# EAGLE schematic MAX86176_WRIST_EVKIT_D (EAGLE 9.2.2)

## Sheet 1 of 2
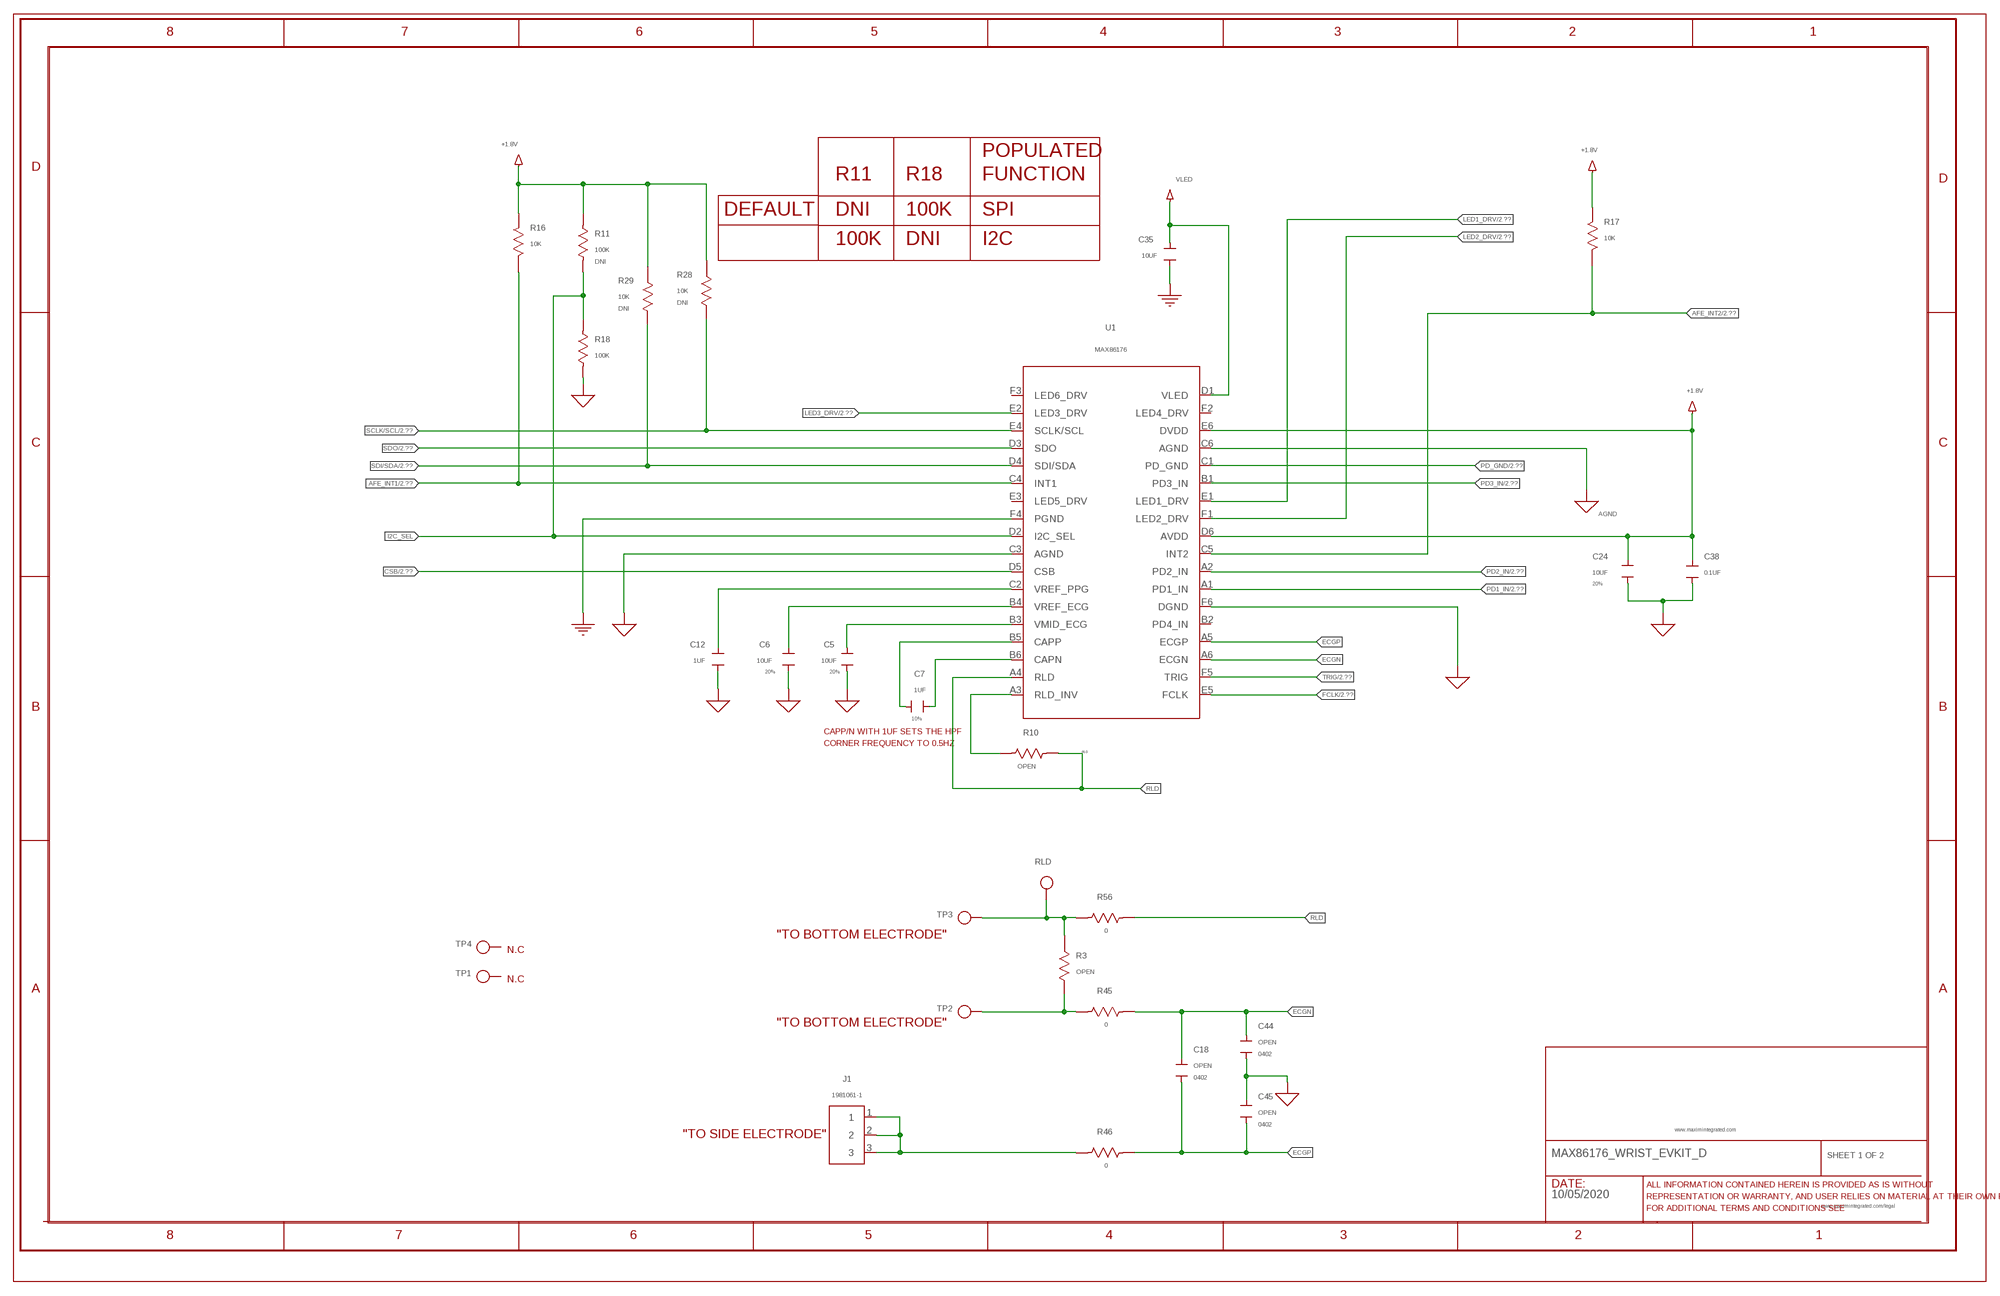
[diagram p0: schematic, sheet 1]
MAXIM_B_SIZE_CF_SYM_1_INST_0 (MAXIM_B_SIZE_CF): COLOR: Default; COMMENT_BODY: TRUE; CURRENT_DESIGN_SHEET: Page 1; CUSTOM_TXT_CDS21: SHEET 1 OF 2; DATE_TXT_CDS: 10/05/2020; DESIGN_CREATE_DATE: Monday, April 19, 2021; DESIGN_CREATE_TIME: 17:09:17; DESIGN_FILE_NAME: C:\TEST\ELGRIS\CHDL2EAGLE\MAXIM\MAX86176\MAX86176_WRIST_EVKIT_D.DSN; DESIGN_MODIFY_DATE: Tuesday, April 20, 2021; DESIGN_MODIFY_TIME: 16:32:23; DESIGN_NAME: C:\TEST\ELGRIS\CHDL2EAGLE\MAXIM\MAX86176\MAX86176_WRIST_EVKIT_D.DSN; LEGAL_WEBLINK_TXT_CDS: www.maximintegrated.com/legal; LOCATION_X-COORDINATE: 5; LOCATION_Y-COORDINATE: 4; ORIGINALSYMBOLORIGIN: (175,5230); PAGE_CREATE_DATE: Monday, April 19, 2021; PAGE_CREATE_TIME: 17:09:20; PAGE_MODIFY_DATE: Tuesday, April 20, 2021; PAGE_MODIFY_TIME: 16:32:23; PAGE_NUMBER: 1; PAGE_SIZE: Custom; PROJECT_TITLE_TXT_CDS: MAX86176_WRIST_EVKIT_D; SCHEMATIC_CREATE_DATE: Monday, April 19, 2021; SCHEMATIC_CREATE_TIME: 10:09:22; SCHEMATIC_MODIFY_DATE: Tuesday, April 20, 2021; SCHEMATIC_MODIFY_TIME: 09:32:24; SCHEMATIC_NAME: MAX86176_WRIST_EVKIT_D; SCHEMATIC_PAGE_COUNT: 2; SCHEMATIC_PAGE_NUMBER: 1; SOURCE_LIBRARY: D:\MAXIM\CHDL2EAGLE\19APR21\MAXREFDES104\MAX86176_WRIST_EVKIT_D\MML.OLB; SOURCE_SYMBOL: MAXIM_B_SIZE_CF; WEBLINK1_TXT_CDS: www.maximintegrated.com

### Parts
C5  10UF  CAP_NP#1CAP_NP#1_1  [0402]
C6  10UF  CAP_NP#1CAP_NP#1_1  [0402]
C7  1UF  CAP_NP#1CAP_NP#1  [0603]
C12  1UF  CAP_NPCAP_NP_1  [0402]
C18  OPEN  EVK_GENERIC_CAPACITORS  [0402]
C24  10UF  EK_CAP_NP#1  [0603]
C35  10UF  EK_CAP_NP  [0603]
C38  0.1UF  CAP_NPCAP_NP_2  [0603]
C44  OPEN  EVK_GENERIC_CAPACITORS  [0402]
C45  OPEN  EVK_GENERIC_CAPACITORS  [0402]
J1  1981061-1  [TECO_1981061-1]
R3  OPEN  EVK_GENERIC_RESISTORS#1  [RESC0603X33M]
R10  OPEN  EVK_GENERIC_RESISTORSEVK_GENERIC_RESISTORS_1  [0402]
R11  100K  RES_SMD#1RES_SMD#1_1  [0402]
R16  10K  RES_SMD  [0402]
R17  10K  RES_SMD  [0402]
R18  100K  RES_SMD#1RES_SMD#1_1  [0402]
R28  10K  RES_SMD  [0402]
R29  10K  RES_SMD  [0402]
R45  0  RES_SMD#1RES_SMD#1_1  [0402]
R46  0  RES_SMD#1RES_SMD#1_1  [0402]
R56  0  RES_SMD#1RES_SMD#1_1  [0402]
RLD  N/A  TPTP  [TP_C25H12]
TP1  N/A  TPTP_1  [TP_S_SQUARE_3-50]
TP2  N/A  TPTP_1  [TP_S_SQUARE_3-50]
TP3  N/A  TPTP_1  [TP_S_SQUARE_3-50]
TP4  N/A  TPTP_1  [TP_S_SQUARE_3-50]
U1  MAX86176  EK_MAX86176  [MAXIM_21-100413]

### Nets
+1.8V: C24.2 C38.2 R11.2 R16.2 R17.2 R28.1 R29.1 U1.D6(AVDD) U1.E6(DVDD) ; also sheet 2
AFE_INT1: R16.1 U1.C4(INT1) ; also sheet 2
AFE_INT2: R17.1 U1.C5(INT2) ; also sheet 2
AGND: C5.1 C6.1 C12.1 C24.1 C38.1 C44.1 C45.2 R18.1 U1.C3(AGND) U1.C6(AGND) U1.F6(DGND) ; also sheet 2
CSB: U1.D5(CSB) ; also sheet 2
ECGN: C18.2 C44.2 R45.2 U1.A6(ECGN)
ECGP: C18.1 C45.1 R46.2 U1.A5(ECGP)
FCLK: U1.E5(FCLK) ; also sheet 2
I2C_SEL: R11.1 R18.2 U1.D2(I2C_SEL)
LED1_DRV: U1.E1(LED1_DRV) ; also sheet 2
LED2_DRV: U1.F1(LED2_DRV) ; also sheet 2
LED3_DRV: U1.E2(LED3_DRV) ; also sheet 2
N00317: J1.1 J1.2 J1.3 R46.1
N00329: C7.1 U1.B6(CAPN)
N00335: C7.2 U1.B5(CAPP)
N00341: C5.2 U1.B3(VMID_ECG)
N00345: C6.2 U1.B4(VREF_ECG)
N00349: C12.2 U1.C2(VREF_PPG)
N00353: R10.1 U1.A3(RLD_INV)
N00359: R3.2 R45.1 TP2.1(TP1)
N00365: R3.1 R56.1 RLD.1(TP1) TP3.1(TP1)
PD1_IN: U1.A1(PD1_IN) ; also sheet 2
PD2_IN: U1.A2(PD2_IN) ; also sheet 2
PD3_IN: U1.B1(PD3_IN) ; also sheet 2
PD_GND: U1.C1(PD_GND) ; also sheet 2
PGND: C35.1 U1.F4(PGND) ; also sheet 2
RLD: R10.2 R56.2 U1.A4(RLD)
SCLK/SCL: R28.2 U1.E4(SCLK/SCL) ; also sheet 2
SDI/SDA: R29.2 U1.D4(SDI/SDA) ; also sheet 2
SDO: U1.D3(SDO) ; also sheet 2
TRIG: U1.F5(TRIG) ; also sheet 2
VLED: C35.2 U1.D1(VLED) ; also sheet 2
Unconnected: TP1.1(TP1) TP4.1(TP1) U1.B2(PD4_IN) U1.E3(LED5_DRV) U1.F2(LED4_DRV) U1.F3(LED6_DRV)

### Notes on the sheet
- POPULATED
- R11 | R18 | FUNCTION
- DEFAULT | DNI | 100K | SPI
- 100K | DNI | I2C
- CAPP/N WITH 1UF SETS THE HPF
- CORNER FREQUENCY TO 0.5HZ
- "TO BOTTOM ELECTRODE"
- N.C
- N.C
- "TO BOTTOM ELECTRODE"
- "TO SIDE ELECTRODE"

## Sheet 2 of 2
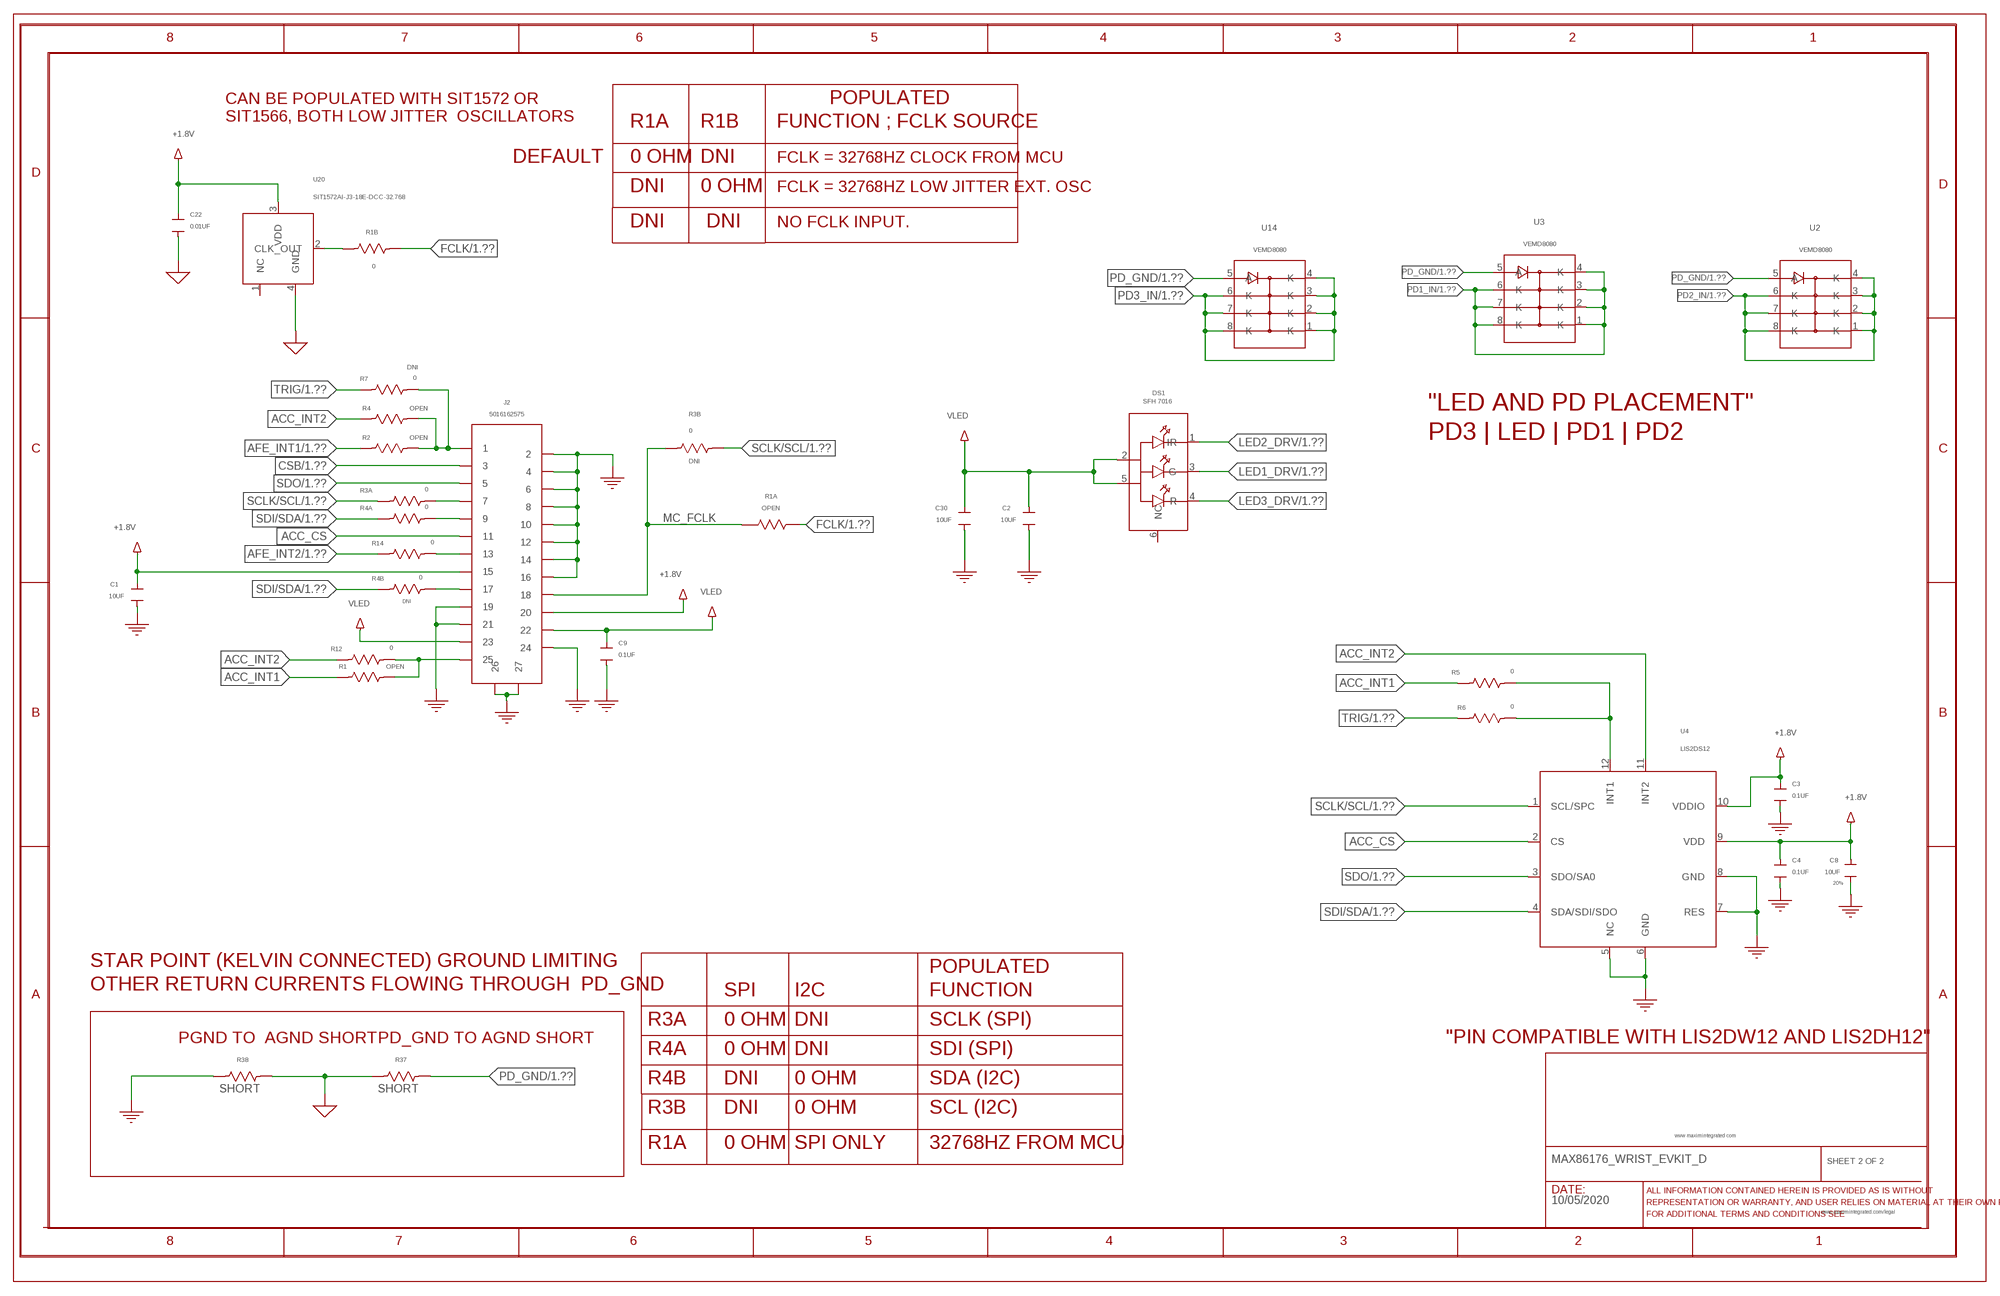
[diagram p1: schematic, sheet 2]
MAXIM_B_SIZE_CF_SYM_1_INST_1___1 (MAXIM_B_SIZE_CF): COLOR: Default; COMMENT_BODY: TRUE; CURRENT_DESIGN_SHEET: page 2; CUSTOM_TXT_CDS21: SHEET 2 OF 2; DATE_TXT_CDS: 10/05/2020; DESIGN_CREATE_DATE: Monday, April 19, 2021; DESIGN_CREATE_TIME: 17:09:17; DESIGN_FILE_NAME: C:\TEST\ELGRIS\CHDL2EAGLE\MAXIM\MAX86176\MAX86176_WRIST_EVKIT_D.DSN; DESIGN_MODIFY_DATE: Tuesday, April 20, 2021; DESIGN_MODIFY_TIME: 16:32:23; DESIGN_NAME: C:\TEST\ELGRIS\CHDL2EAGLE\MAXIM\MAX86176\MAX86176_WRIST_EVKIT_D.DSN; LEGAL_WEBLINK_TXT_CDS: www.maximintegrated.com/legal; LOCATION_X-COORDINATE: 5; LOCATION_Y-COORDINATE: 9; ORIGINALSYMBOLORIGIN: (175,5230); PAGE_CREATE_DATE: Monday, April 19, 2021; PAGE_CREATE_TIME: 17:09:20; PAGE_MODIFY_DATE: Tuesday, April 20, 2021; PAGE_MODIFY_TIME: 16:32:23; PAGE_NUMBER: 2; PAGE_SIZE: Custom; PROJECT_TITLE_TXT_CDS: MAX86176_WRIST_EVKIT_D; SCHEMATIC_CREATE_DATE: Monday, April 19, 2021; SCHEMATIC_CREATE_TIME: 10:09:22; SCHEMATIC_MODIFY_DATE: Tuesday, April 20, 2021; SCHEMATIC_MODIFY_TIME: 09:32:24; SCHEMATIC_NAME: MAX86176_WRIST_EVKIT_D; SCHEMATIC_PAGE_COUNT: 2; SCHEMATIC_PAGE_NUMBER: 2; SOURCE_LIBRARY: D:\MAXIM\CHDL2EAGLE\19APR21\MAXREFDES104\MAX86176_WRIST_EVKIT_D\MML.OLB; SOURCE_SYMBOL: MAXIM_B_SIZE_CF; WEBLINK1_TXT_CDS: www.maximintegrated.com

### Parts
C1  10UF  EK_CAP_NP  [0603]
C2  10UF  EK_CAP_NP  [0603]
C3  0.1UF  CAP_NPCAP_NP_2  [0603]
C4  0.1UF  CAP_NPCAP_NP_2  [0603]
C8  10UF  CAP_NP#1CAP_NP#1_1  [0402]
C9  0.1UF  CAP_NPCAP_NP  [CAPC0603X33M]
C22  0.01UF  CAP_NPCAP_NP  [CAPC0603X33M]
C30  10UF  EK_CAP_NP  [0603]
DS1  SFH 7016  LED_6P  [LED_SFH7016]
J2  5016162575  501616-2575  [MOLEX_501616-2575]
R1  OPEN  EVK_GENERIC_RESISTORSEVK_GENERIC_RESISTORS_1  [0402]
R1A  OPEN  EVK_GENERIC_RESISTORS#1  [RESC0603X33M]
R1B  0  RES_SMD#1RES_SMD#1  [RESC0603X33M]
R2  OPEN  EVK_GENERIC_RESISTORSEVK_GENERIC_RESISTORS_1  [0402]
R3A  0  RES_SMD#1RES_SMD#1_1  [0402]
R3B  0  RES_SMD#1RES_SMD#1_1  [0402]
R4  OPEN  EVK_GENERIC_RESISTORSEVK_GENERIC_RESISTORS_1  [0402]
R4A  0  RES_SMD#1RES_SMD#1_1  [0402]
R4B  0  RES_SMD#1RES_SMD#1_1  [0402]
R5  0  RES_SMD#1RES_SMD#1  [RESC0603X33M]
R6  0  RES_SMD#1RES_SMD#1  [RESC0603X33M]
R7  0  RES_SMD#1RES_SMD#1  [RESC0603X33M]
R12  0  RES_SMD#1RES_SMD#1  [RESC0603X33M]
R14  0  RES_SMD#1RES_SMD#1  [RESC0603X33M]
R37  SHORT  EVK_GENERIC_RESISTORSEVK_GENERIC_RESISTORS  [RESC0603X23L_SHORT]
R38  SHORT  EVK_GENERIC_RESISTORSEVK_GENERIC_RESISTORS  [RESC0603X23L_SHORT]
U2  VEMD8080  DIO_PIN_8P  [DIO_VEMD8080]
U3  VEMD8080  DIO_PIN_8P  [DIO_VEMD8080]
U4  LIS2DS12  [STMC_LGA-12]
U14  VEMD8080  DIO_PIN_8P  [DIO_VEMD8080]
U20  SIT1572AI-J3-18E-DCC-32.768  SIT1572  [OSC_SIT1572XX-JX-XXX]

### Nets
+1.8V: C1.2 C3.2 C4.2 C8.2 C22.2 J2.15 J2.20 U4.9(VDD) U4.10(VDDIO) U20.3(VDD) ; also sheet 1
ACC_CS: J2.11 U4.2(CS)
ACC_INT1: R1.1 R5.1
ACC_INT2: R4.1 R12.1 U4.11(INT2)
AFE_INT1: R2.1 ; also sheet 1
AFE_INT2: R14.1 ; also sheet 1
AGND: C22.1 R37.1 R38.2 U20.4(GND) ; also sheet 1
CSB: J2.3 ; also sheet 1
FCLK: R1A.2 R1B.2 ; also sheet 1
LED1_DRV: DS1.3(G) ; also sheet 1
LED2_DRV: DS1.1(IR) ; also sheet 1
LED3_DRV: DS1.4(R) ; also sheet 1
MC_FCLK: J2.18 R1A.1 R3B.1
N01067: J2.1 R2.2 R4.2 R7.2
N01081: J2.13 R14.2
N01083: J2.17 R4B.2
N01085: J2.25 R1.2 R12.2
N01093: J2.7 R3A.2
N01095: J2.9 R4A.2
N01097: R5.2 R6.2 U4.12(INT1)
N01105: R1B.1 U20.2(CLK_OUT)
PD1_IN: U3.1(K) U3.2(K) U3.3(K) U3.4(K) U3.6(K) U3.7(K) U3.8(K) ; also sheet 1
PD2_IN: U2.1(K) U2.2(K) U2.3(K) U2.4(K) U2.6(K) U2.7(K) U2.8(K) ; also sheet 1
PD3_IN: U14.1(K) U14.2(K) U14.3(K) U14.4(K) U14.6(K) U14.7(K) U14.8(K) ; also sheet 1
PD_GND: R37.2 U2.5(A) U3.5(A) U14.5(A) ; also sheet 1
PGND: C1.1 C2.1 C3.1 C4.1 C8.1 C9.1 C30.1 J2.2 J2.4 J2.6 J2.8 J2.10 J2.12 J2.14 J2.16 J2.19 J2.21 J2.24 J2.26 J2.27 R38.1 U4.5(NC) U4.6(GND) U4.7(RES) U4.8(GND) ; also sheet 1
SCLK/SCL: R3A.1 R3B.2 U4.1(SCL/SPC) ; also sheet 1
SDI/SDA: R4A.1 R4B.1 U4.4(SDA/SDI/SDO) ; also sheet 1
SDO: J2.5 U4.3(SDO/SA0) ; also sheet 1
TRIG: R6.1 R7.1 ; also sheet 1
VLED: C2.2 C9.2 C30.2 DS1.2(A_1) DS1.5(A_2) J2.22 J2.23 ; also sheet 1
Unconnected: DS1.6(NC) U20.1(NC)

### Notes on the sheet
- CAN BE POPULATED WITH SIT1572 OR | POPULATED
- SIT1566, BOTH LOW JITTER  OSCILLATORS | R1A | R1B | FUNCTION ; FCLK SOURCE
- DEFAULT | 0 OHM | DNI | FCLK = 32768HZ CLOCK FROM MCU
- DNI | 0 OHM | FCLK = 32768HZ LOW JITTER EXT. OSC
- DNI | DNI | NO FCLK INPUT.
- "LED AND PD PLACEMENT"
- PD3 | LED | PD1 | PD2
- STAR POINT (KELVIN CONNECTED) GROUND LIMITING
- POPULATED
- OTHER RETURN CURRENTS FLOWING THROUGH  PD_GND
- SPI | I2C | FUNCTION
- R3A | 0 OHM | DNI | SCLK (SPI)
- PGND TO  AGND SHORT | PD_GND TO AGND SHORT | "PIN COMPATIBLE WITH LIS2DW12 AND LIS2DH12"
- R4A | 0 OHM | DNI | SDI (SPI)
- R4B | DNI | 0 OHM | SDA (I2C)
- R3B | DNI | 0 OHM | SCL (I2C)
- R1A | 0 OHM | SPI ONLY | 32768HZ FROM MCU

## Library data of the parts
C1 C2 C30 = EVKIT_NONCOMPLIANT:EK_CAP_NP; CAP: 1.00E-05; CASE: SMT (0603); DESCRIPTION: CAP: SMT (0603): 10UF: 20%: 25V: X5R: CERAMIC CHIP; MANUFACTURER: MURATA; MATERIAL_TYPE: CERAMIC CHIP; MAXINV: 20-0010U-P7; MFG_PART_NUMBER: GRM188R61E106MA73; ORIGINALSYMBOLORIGIN: (-50,50); PACK_TYPE: 0603; PHYS_PAGE: 2; REFLOW: -; TEMP_RANGE: -55 DEGC TO +85 DEGC; TOLERANCE: 20%; VER: 2; VLOG_PARAM01: CAP:INTEGER; VOLTAGE_RATING: 25V
C3 C4 = MML:CAP_NP; CAP: 1.00E-07; DESCRIPTION: CAP: SMT (0603): 0.1UF: 10%: 100V: X7R: CERAMIC; MANUFACTURER: YAGEO:MURATA:TAIYO YUDEN:AVX:MURATA; MAXINV: 20-000U1-01; MFG_PART_NUMBER: GRM188R72A104KA35: CC0603KRX7R0BB104; ORIGINALSYMBOLORIGIN: (-50,50); PACK_TYPE: 0603CAP; PHYS_PAGE: 2; REFLOW: -; TEMP_RANGE: -55 DEGC TO +125 DEGC; TOLERANCE: 10%; VER: 2; VLOG_PARAM01: CAP:INTEGER; VOLTAGE_RATING: 100V
C5 C6 = MML:CAP_NP#1; CAP: 1.00E-05; CASE: SMT (0402); DESCRIPTION: CAP: SMT (0402): 10UF: 20%: 10V: X5R: CERAMIC; MANUFACTURER: MURATA:MURATA:AVX:SAMSUNG; MATERIAL_TYPE: CERAMIC CHIP; MAXINV: 20-0010U-BA12; MFG_PART_NUMBER: GRM155R61A106ME44:GRM155R61A106ME11:0402ZD106MAT2A:CL05A106MP5NUNC; ORIGINALSYMBOLORIGIN: (-50,50); PACK_TYPE: 0402CAP; PHYS_PAGE: 1; REFLOW: -; TEMP_RANGE: -55 DEGC TO +85 DEGC; TOLERANCE: 20%; VER: 1; VLOG_PARAM01: CAP:INTEGER; VOLTAGE_RATING: 10V
C7 = MML:CAP_NP#1; CAP: 1.00E-06; CASE: SMT (0603); DESCRIPTION: CAP: SMT (0603): 1UF: 10%: 25V: X7R: CERAMIC; MANUFACTURER: MURATA:TAIYO YUDEN:AVX:TAIYO YUDEN; MATERIAL_TYPE: CERAMIC CHIP; MAXINV: 20-0001U-P6; MFG_PART_NUMBER: GRM188R71E105KA12:CGA3E1X7R1E105K:TMK107B7105KA:06033C105KAT2A:GCM188R71E105KA64:C1608X7R1E105K080AE:CGA3E1X7R1E105K080AC; ORIGINALSYMBOLORIGIN: (-50,50); PACK_TYPE: 0603CAP; PHYS_PAGE: 1; REFLOW: -; TEMP_RANGE: -55 DEGC TO +125 DEGC; TOLERANCE: 10%; VER: 1; VLOG_PARAM01: CAP:INTEGER; VOLTAGE_RATING: 25V
C8 = MML:CAP_NP#1; CAP: 1.00E-05; CASE: SMT (0402); DESCRIPTION: CAP: SMT (0402): 10UF: 20%: 10V: X5R: CERAMIC; MANUFACTURER: MURATA:MURATA:AVX:SAMSUNG; MAXINV: 20-0010U-BA12; MFG_PART_NUMBER: GRM155R61A106ME44:GRM155R61A106ME11:0402ZD106MAT2A:CL05A106MP5NUNC; ORIGINALSYMBOLORIGIN: (-50,50); PACK_TYPE: 0402CAP; PHYS_PAGE: 2; REFLOW: -; TEMP_RANGE: -55 DEGC TO +85 DEGC; TOLERANCE: 20%; VER: 1; VLOG_PARAM01: CAP:INTEGER; VOLTAGE_RATING: 10V
C9 = MML:CAP_NP; CAP: 1.00E-07; CASE: SMT (0201); DESCRIPTION: CAP: SMT (0201): 0.1UF: 10%: 10V: X5R: CERAMIC; MANUFACTURER: MURATA:TAIYO YUDEN; MATERIAL_TYPE: CERAMIC; MAXINV: 20-000U1-H9; MFG_PART_NUMBER: GRM033R61A104KE15: LMK063BJ104KP; ORIGINALSYMBOLORIGIN: (-50,50); PACK_TYPE: 0201CAPM; PHYS_PAGE: 2; REFLOW: -; TEMP_RANGE: -55 DEGC TO +85 DEGC; TOLERANCE: N/A; VER: 2; VLOG_PARAM01: CAP:INTEGER; VOLTAGE_RATING: 10V
C12 = MML:CAP_NP; CAP: 1.00E-06; CASE: SMT (0402); DESCRIPTION: CAP: SMT (0402): 1UF: 10%: 16V: X5R: CERAMIC; MANUFACTURER: SAMSUNG; MATERIAL_TYPE: CERAMIC CHIP; MAXINV: EC2430; MFG_PART_NUMBER: CL05A105KO5NNN; ORIGINALSYMBOLORIGIN: (-50,50); PACK_TYPE: 0402CAP; PHYS_PAGE: 1; REFLOW: -; TEMP_RANGE: -55 DEGC TO +85 DEGC; TOLERANCE: 10%; VER: 2; VLOG_PARAM01: CAP:INTEGER; VOLTAGE_RATING: 16V
C18 C44 C45 = EVKIT_NONCOMPLIANT:EVK_GENERIC_CAPACITORS; CASE: N/A; DESCRIPTION: PACKAGE OUTLINE 0402 NON-POLAR CAPACITOR - EVKIT; MANUFACTURER: N/A; MATERIAL_TYPE: N/A; MAXINV: N/A; MFG_PART_NUMBER: N/A; ORIGINALSYMBOLORIGIN: (-50,50); PACK_TYPE: 0402CAP; PHYS_PAGE: 1; TEMP_RANGE: N/A; TOLERANCE: N/A; VER: 1; VOLTAGE_RATING: N/A
C22 = MML:CAP_NP; CAP: 1.00E-08; CASE: SMT (0201); DESCRIPTION: CAP: SMT (0201): 0.01UF: 10%: 10V: X7R: CERAMIC; MANUFACTURER: TDK:MURATA:MURATA:TDK:AVX; MATERIAL_TYPE: CERAMIC CHIP; MAXINV: 20-00U01-I6; MFG_PART_NUMBER: C0603X7R1A103K030BA:GRM033R71A103KA01:GCM033R71A103KA03:CGA1A2X7R1A103K030BA:0201ZC103KAT2A; ORIGINALSYMBOLORIGIN: (-50,50); PACK_TYPE: 0201CAPM; PHYS_PAGE: 2; REFLOW: -; TEMP_RANGE: -55 DEGC TO +125 DEGC; TOLERANCE: 10%; VER: 2; VLOG_PARAM01: CAP:INTEGER; VOLTAGE_RATING: 10V
C24 = EVKIT_NONCOMPLIANT:EK_CAP_NP#1; CAP: 1.00E-05; CASE: SMT (0603); DESCRIPTION: CAP: SMT (0603): 10UF: 20%: 25V: X5R: CERAMIC CHIP; MANUFACTURER: MURATA; MATERIAL_TYPE: CERAMIC CHIP; MAXINV: 20-0010U-P7; MFG_PART_NUMBER: GRM188R61E106MA73; ORIGINALSYMBOLORIGIN: (-50,50); PACK_TYPE: 0603; PHYS_PAGE: 1; REFLOW: -; TEMP_RANGE: -55 DEGC TO +85 DEGC; TOLERANCE: 20%; VER: 1; VLOG_PARAM01: CAP:INTEGER; VOLTAGE_RATING: 25V
C35 = EVKIT_NONCOMPLIANT:EK_CAP_NP; CAP: 1.00E-05; CASE: SMT (0603); DESCRIPTION: CAP: SMT (0603): 10UF: 20%: 25V: X5R: CERAMIC CHIP; MANUFACTURER: MURATA; MATERIAL_TYPE: CERAMIC CHIP; MAXINV: 20-0010U-P7; MFG_PART_NUMBER: GRM188R61E106MA73; ORIGINALSYMBOLORIGIN: (-50,50); PACK_TYPE: 0603; PHYS_PAGE: 1; REFLOW: -; TEMP_RANGE: -55 DEGC TO +85 DEGC; TOLERANCE: 20%; VER: 2; VLOG_PARAM01: CAP:INTEGER; VOLTAGE_RATING: 25V
C38 = MML:CAP_NP; CAP: 1.00E-07; DESCRIPTION: CAP: SMT (0603): 0.1UF: 10%: 100V: X7R: CERAMIC; MANUFACTURER: YAGEO:MURATA:TAIYO YUDEN:AVX:MURATA; MAXINV: 20-000U1-01; MFG_PART_NUMBER: GRM188R72A104KA35: CC0603KRX7R0BB104; ORIGINALSYMBOLORIGIN: (-50,50); PACK_TYPE: 0603CAP; PHYS_PAGE: 1; REFLOW: -; TEMP_RANGE: -55 DEGC TO +125 DEGC; TOLERANCE: 10%; VER: 2; VLOG_PARAM01: CAP:INTEGER; VOLTAGE_RATING: 100V
DS1 = MML:LED_6P; DESCRIPTION: DIODE: LED: RED-GREEN-IR: SMT: VF=RED=2.1V: GREEN=2.5V: IR=1.3V: IF=RED=0.04A: GREEN=0.03A: IR=0.06A :NOTE:PURCHASE DIRECT FROM THE MANUFACTURER; MANUFACTURER: OSRAM; MAXINV: ED111000003532; MFG_PART_NUMBER: SFH 7016; ORIGINALSYMBOLORIGIN: (-125,250); PACK_TYPE: LED_SFH7016; PHYS_PAGE: 2; SEC_TYPE: LED_SFH7016; TEMP_RANGE: -40 DEGC TO +85 DEGC; TOLERANCE: N/A; VER: 7; VOLTAGE_RATING: RED=2.1V: GREEN=2.5V: IR=1.3V
J1 = MML:1981061-1; DESCRIPTION: CONNECTOR: MALE: SMD: LEAF TYPE BATTERY CONNECTOR: WITHOUT BOSS: 3 PINS; MANUFACTURER: TYCO; MAXINV: EH111000003993; MFG_PART_NUMBER: 1981061-1; ORIGINALSYMBOLORIGIN: (-75,125); PACK_TYPE: SMD; PHYS_PAGE: 1; REFLOW: -; TEMP_RANGE: N/A; TOLERANCE: N/A; VER: 1; VOLTAGE_RATING: N/A
J2 = MML:501616-2575; DESCRIPTION: CONNECTOR: FEMALE: SMT: EASY-ON TYPE FPC CONNECTOR: RIGHT ANGLE: 25PINS :NOTE:DISCONTINUED BY MANUFACTURER; MANUFACTURER: MOLEX; MAXINV: 01-501616257525P-29; MFG_PART_NUMBER: 5016162575; ORIGINALSYMBOLORIGIN: (-150,550); PACK_TYPE: RA; PHYS_PAGE: 2; REFLOW: -; SEC_TYPE: RA; TEMP_RANGE: -40 DEGC TO +85 DEGC; TOLERANCE: N/A; VER: 1; VOLTAGE_RATING: +50V
R1 R2 R4 = EVKIT_NONCOMPLIANT:EVK_GENERIC_RESISTORS; CASE: SMT (0402); DESCRIPTION: PACKAGE OUTLINE 0402 RESISTOR - EVKIT; MANUFACTURER: N/A; MATERIAL_TYPE: N/A; MAXINV: N/A; MFG_PART_NUMBER: N/A; ORIGINALSYMBOLORIGIN: (-75,50); PACK_TYPE: 0402RES; PHYS_PAGE: 2; POWER_RATING: N/A; TEMP_RANGE: N/A; TOLERANCE: N/A; VER: 2; VOLTAGE_RATING: N/A
R1A = EVKIT_NONCOMPLIANT:EVK_GENERIC_RESISTORS#1; CASE: SMT (0201); DESCRIPTION: PACKAGE OUTLINE 0201 RESISTOR - EVKIT; MANUFACTURER: N/A; MAXINV: N/A; MFG_PART_NUMBER: N/A; ORIGINALSYMBOLORIGIN: (-50,75); PACK_TYPE: 0201RES; PHYS_PAGE: 2; POWER_RATING: N/A; TEMP_RANGE: N/A; TOLERANCE: N/A; VER: 4; VOLTAGE_RATING: N/A
R1B R14 = MML:RES_SMD#1; CASE: SMT (0201); DESCRIPTION: RES: SMT (0201): 0: 1%: JUMPER: 0.0500W; MANUFACTURER: VISHAY DALE:PANASONIC; MAXINV: 80-0000R-95; MFG_PART_NUMBER: CRCW02010000ZS:ERJ-1GN0R00; ORIGINALSYMBOLORIGIN: (-75,50); PACK_TYPE: 0201RES; PHYS_PAGE: 2; POWER_RATING: 0.05W; REFLOW: -; RES: 0.00000001E00; TEMP_RANGE: -55 DEGC TO +155 DEGC; TOLERANCE: 1%; VER: 2; VLOG_PARAM01: RES:INTEGER
R3 = EVKIT_NONCOMPLIANT:EVK_GENERIC_RESISTORS#1; CASE: SMT (0201); DESCRIPTION: PACKAGE OUTLINE 0201 RESISTOR - EVKIT; MANUFACTURER: N/A; MATERIAL_TYPE: N/A; MAXINV: N/A; MFG_PART_NUMBER: N/A; ORIGINALSYMBOLORIGIN: (-50,75); PACK_TYPE: 0201RES; PHYS_PAGE: 1; POWER_RATING: N/A; TEMP_RANGE: N/A; TOLERANCE: N/A; VER: 4; VOLTAGE_RATING: N/A
R3A R4A = MML:RES_SMD#1; CASE: SMT (0402); DESCRIPTION: RES: SMT (0402): 0: JUMPER: JUMPER: 0.1000W; MANUFACTURER: PANASONIC; MATERIAL_TYPE: THICK FILM; MAXINV: 80-0000R-26A; MFG_PART_NUMBER: ERJ-2GE0R00; ORIGINALSYMBOLORIGIN: (-75,50); PACK_TYPE: 0402RES; PHYS_PAGE: 2; POWER_RATING: 0.10W; REFLOW: -; RES: 0.00000001E00; TEMP_RANGE: -55 DEGC TO +155 DEGC; TOLERANCE: 0%; VER: 2; VLOG_PARAM01: RES:INTEGER
R3B R4B = MML:RES_SMD#1; CASE: SMT (0402); DESCRIPTION: RES: SMT (0402): 0: JUMPER: JUMPER: 0.1000W; MANUFACTURER: PANASONIC; MATERIAL_TYPE: THICK FILM; MAXINV: 80-0000R-26A; MFG_PART_NUMBER: ERJ-2GE0R00; ORIGINALSYMBOLORIGIN: (-75,50); PACK_TYPE: 0402RES; PHYS_PAGE: 2; POWER_RATING: 0.10W; REFLOW: -; RES: 0.00000001E00; TEMP_RANGE: -55 DEGC TO +155 DEGC; TOLERANCE: 0%; VARIANT: DNI; VER: 2; VLOG_PARAM01: RES:INTEGER
R5 R6 R12 = MML:RES_SMD#1; CASE: SMT (0201); DESCRIPTION: RES: SMT (0201): 0: 1%: JUMPER: 0.0500W; MANUFACTURER: VISHAY DALE:PANASONIC; MATERIAL_TYPE: THICK FILM; MAXINV: 80-0000R-95; MFG_PART_NUMBER: CRCW02010000ZS:ERJ-1GN0R00; ORIGINALSYMBOLORIGIN: (-75,50); PACK_TYPE: 0201RES; PHYS_PAGE: 2; POWER_RATING: 0.05W; REFLOW: -; RES: 0.00000001E00; TEMP_RANGE: -55 DEGC TO +155 DEGC; TOLERANCE: 1%; VER: 2; VLOG_PARAM01: RES:INTEGER
R7 = MML:RES_SMD#1; CASE: SMT (0201); DESCRIPTION: RES: SMT (0201): 0: 1%: JUMPER: 0.0500W; MANUFACTURER: VISHAY DALE:PANASONIC; MATERIAL_TYPE: THICK FILM; MAXINV: 80-0000R-95; MFG_PART_NUMBER: CRCW02010000ZS:ERJ-1GN0R00; ORIGINALSYMBOLORIGIN: (-75,50); PACK_TYPE: 0201RES; PHYS_PAGE: 2; POWER_RATING: 0.05W; REFLOW: -; RES: 0.00000001E00; TEMP_RANGE: -55 DEGC TO +155 DEGC; TOLERANCE: 1%; VARIANT: DNI; VER: 2; VLOG_PARAM01: RES:INTEGER
R10 = EVKIT_NONCOMPLIANT:EVK_GENERIC_RESISTORS; CASE: SMT (0402); DESCRIPTION: PACKAGE OUTLINE 0402 RESISTOR - EVKIT; MANUFACTURER: N/A; MATERIAL_TYPE: N/A; MAXINV: N/A; MFG_PART_NUMBER: N/A; ORIGINALSYMBOLORIGIN: (-75,50); PACK_TYPE: 0402RES; PHYS_PAGE: 1; POWER_RATING: N/A; TEMP_RANGE: N/A; TOLERANCE: N/A; VER: 2; VOLTAGE_RATING: N/A
R11 = MML:RES_SMD#1; CASE: SMT (0402); DESCRIPTION: RES: SMT (0402): 100K: 1%: +/-100PPM/DEGC: 0.1000W; MANUFACTURER: PANASONIC; MATERIAL_TYPE: THICK FILM; MAXINV: 80-0100K-18; MFG_PART_NUMBER: ERJ-2RKF1003; ORIGINALSYMBOLORIGIN: (-75,50); PACK_TYPE: 0402RES; PHYS_PAGE: 1; POWER_RATING: 0.10W; REFLOW: -; RES: 1.00E05; TEMP_RANGE: -55 DEGC TO +155 DEGC; TOLERANCE: 1%; VARIANT: DNI; VER: 2; VLOG_PARAM01: RES:INTEGER
R16 R17 = MML:RES_SMD; CASE: SMT (0402); DESCRIPTION: RES: SMT (0402): 10K: 1%: +/-100PPM/DEGC: 0.1000W; MANUFACTURER: PANASONIC; MATERIAL_TYPE: THICK FILM; MAXINV: 80-0010K-18; MFG_PART_NUMBER: ERJ-2RKF1002; ORIGINALSYMBOLORIGIN: (-50,75); PACK_TYPE: 0402RES; PHYS_PAGE: 1; POWER_RATING: 0.10W; REFLOW: -; RES: 1.00E04; TEMP_RANGE: -55 DEGC TO +155 DEGC; TOLERANCE: 1%; VER: 4; VLOG_PARAM01: RES:INTEGER
R18 = MML:RES_SMD#1; CASE: SMT (0402); DESCRIPTION: RES: SMT (0402): 100K: 1%: +/-100PPM/DEGC: 0.1000W; MANUFACTURER: PANASONIC; MATERIAL_TYPE: THICK FILM; MAXINV: 80-0100K-18; MFG_PART_NUMBER: ERJ-2RKF1003; ORIGINALSYMBOLORIGIN: (-75,50); PACK_TYPE: 0402RES; PHYS_PAGE: 1; POWER_RATING: 0.10W; REFLOW: -; RES: 1.00E05; TEMP_RANGE: -55 DEGC TO +155 DEGC; TOLERANCE: 1%; VER: 2; VLOG_PARAM01: RES:INTEGER
R28 R29 = MML:RES_SMD; CASE: SMT (0402); DESCRIPTION: RES: SMT (0402): 10K: 1%: +/-100PPM/DEGC: 0.1000W; MANUFACTURER: PANASONIC; MATERIAL_TYPE: THICK FILM; MAXINV: 80-0010K-18; MFG_PART_NUMBER: ERJ-2RKF1002; ORIGINALSYMBOLORIGIN: (-50,75); PACK_TYPE: 0402RES; PHYS_PAGE: 1; POWER_RATING: 0.10W; REFLOW: -; RES: 1.00E04; TEMP_RANGE: -55 DEGC TO +155 DEGC; TOLERANCE: 1%; VARIANT: DNI; VER: 4; VLOG_PARAM01: RES:INTEGER
R37 R38 = EVKIT_NONCOMPLIANT:EVK_GENERIC_RESISTORS; CASE: SMT (0201); DESCRIPTION: PACKAGE OUTLINE 0201 RESISTOR - EVKIT FORM FACTOR FOOTRINT; MANUFACTURER: N/A; MATERIAL_TYPE: N/A; MAXINV: N/A; MFG_PART_NUMBER: N/A; ORIGINALSYMBOLORIGIN: (-75,50); PACK_TYPE: 0201RES_FF; PHYS_PAGE: 2; POWER_RATING: N/A; TEMP_RANGE: N/A; TOLERANCE: N/A; VER: 2; VOLTAGE_RATING: N/A
R45 R46 R56 = MML:RES_SMD#1; CASE: SMT (0402); DESCRIPTION: RES: SMT (0402): 0: JUMPER: JUMPER: 0.1000W; MANUFACTURER: PANASONIC; MATERIAL_TYPE: THICK FILM; MAXINV: 80-0000R-26A; MFG_PART_NUMBER: ERJ-2GE0R00; ORIGINALSYMBOLORIGIN: (-75,50); PACK_TYPE: 0402RES; PHYS_PAGE: 1; POWER_RATING: 0.10W; REFLOW: -; RES: 0.00000001E00; TEMP_RANGE: -55 DEGC TO +155 DEGC; TOLERANCE: 0%; VER: 2; VLOG_PARAM01: RES:INTEGER
RLD = MML:TP; DESCRIPTION: TESTPOINT WITH 12 MILS HOLE DIA, and 25 MILS PAD DIA: NOT FOR COLD TEST; MANUFACTURER: N/A; MAXINV: N/A; MFG_PART_NUMBER: N/A; ORIGINALSYMBOLORIGIN: (-125,50); PACK_TYPE: TP; PART_NAME: TP; PHYS_PAGE: 1; REFLOW: -; TEMP_RANGE: N/A; TOLERANCE: N/A; VER: 1; VOLTAGE_RATING: N/A
TP1-TP4 = MML:TP; DESCRIPTION: TESTPOINT WITH 3.50MM SQUARE PAD DIAMETER; MANUFACTURER: N/A; MAXINV: N/A; MFG_PART_NUMBER: N/A; ORIGINALSYMBOLORIGIN: (-125,50); PACK_TYPE: TP; PART_NAME: TP; PHYS_PAGE: 1; REFLOW: -; TEMP_RANGE: N/A; TOLERANCE: N/A; VER: 1; VOLTAGE_RATING: N/A
U1 = EVKIT_NONCOMPLIANT:EK_MAX86176; DESCRIPTION: EVKIT PART - IC: MAX86176: ULTRA-LOW POWER: OPTICAL PPG AND SINGLE LEAD ECD AFE: PACKAGE OUTLINE DRAWING: 21-100413: PACKAGE CODE: N362D2+1; MANUFACTURER: MAXIM; MAXINV: N/A; MFG_PART_NUMBER: MAX86176; ORIGINALSYMBOLORIGIN: (-375,775); PACK_TYPE: WLP36_1; PHYS_PAGE: 1; REFLOW: -; SEC_TYPE: WLP36_1; TEMP_RANGE: -40 DEGC TO +85 DEGC; TOLERANCE: N/A; VER: 5; VOLTAGE_RATING: +1.7V TO +2V
U2 U3 U14 = MML:DIO_PIN_8P; DESCRIPTION: DIODE: PIN: SMT: VRM=20V: IF=0.05A :NOTE:PURCHASE DIRECT FROM THE MANUFACTURER; MANUFACTURER: VISHAY; MAXINV: ED1259; MFG_PART_NUMBER: VEMD8080; ORIGINALSYMBOLORIGIN: (-150,200); PACK_TYPE: SMD; PHYS_PAGE: 2; SEC_TYPE: SMD; TEMP_RANGE: -40 DEGC TO +85 DEGC; TOLERANCE: N/A; VER: 1; VOLTAGE_RATING: 20V
U4 = MML:LIS2DS12; CASE: LGA12; DESCRIPTION: IC: MEMS: DIGITAL OUTPUT MOTION SENSOR: ULTRA-LOW-POWER HIGH-PERFORMANCE 3-AXIS PICO ACCELEROMETER: MICROELECTROMECHANICAL SYSTEMS: LGA12: NOTE: MANUFACTURER; MANUFACTURER: ST MICROELECTRONICS; MAXINV: EQ111000005315; MFG_PART_NUMBER: LIS2DS12; ORIGINALSYMBOLORIGIN: (-375,375); PACK_TYPE: LGA12; PHYS_PAGE: 2; TEMP_RANGE: -40 DEGC TO +85 DEGC; TOLERANCE: N/A; VER: 1; VOLTAGE_RATING: +1.62V TO +1.98V
U20 = MML:SIT1572; DESCRIPTION: OSCILLATOR: CSP 1.5 MM X 0.8 MM: 15PF: 32.768KHZ : +/-10PPM; MANUFACTURER: SITIME CORPORATION; MAXINV: EX111000005339; MFG_PART_NUMBER: SIT1572AI-J3-18E-DCC-32.768; ORIGINALSYMBOLORIGIN: (-175,200); PACK_TYPE: SMD; PHYS_PAGE: 2; TEMP_RANGE: -40 DEGC TO +85 DEGC; TOLERANCE: N/A; VER: 1; VOLTAGE_RATING: +1.8V